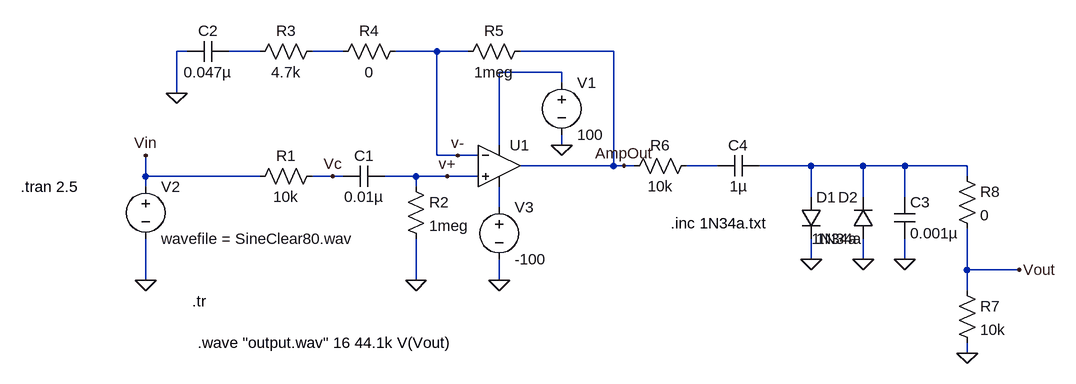
[diagram p0: schematic MxrDistortionPlus.asc]
MxrDistortionPlus.asc, the LTspice schematic file:
Version 4
SHEET 1 1316 680
WIRE -32 64 -48 64
WIRE 80 64 32 64
WIRE 208 64 160 64
WIRE 352 64 288 64
WIRE 400 64 352 64
WIRE 624 64 480 64
WIRE 544 96 448 96
WIRE 544 112 544 96
WIRE -48 128 -48 64
WIRE 448 208 448 96
WIRE 544 208 544 192
WIRE 352 224 352 64
WIRE 384 224 352 224
WIRE 416 224 384 224
WIRE 624 240 624 64
WIRE 624 240 480 240
WIRE 640 240 624 240
WIRE 656 240 640 240
WIRE 784 240 736 240
WIRE 928 240 848 240
WIRE 1008 240 928 240
WIRE 1072 240 1008 240
WIRE 1168 240 1072 240
WIRE -96 256 -96 224
WIRE 80 256 -96 256
WIRE 192 256 160 256
WIRE 208 256 192 256
WIRE 320 256 272 256
WIRE 368 256 320 256
WIRE 416 256 368 256
WIRE 1168 256 1168 240
WIRE -96 272 -96 256
WIRE 320 272 320 256
WIRE 928 288 928 240
WIRE 1008 288 1008 240
WIRE 1072 288 1072 240
WIRE 448 304 448 272
WIRE 928 384 928 352
WIRE 1008 384 1008 352
WIRE 1072 384 1072 352
WIRE 1168 400 1168 336
WIRE 1248 400 1168 400
WIRE -96 416 -96 352
WIRE 320 416 320 352
WIRE 448 416 448 384
WIRE 1168 432 1168 400
WIRE 1168 528 1168 512
FLAG 320 416 0
FLAG -96 224 Vin
FLAG 192 256 Vc
FLAG -96 416 0
FLAG 544 208 0
FLAG -48 128 0
FLAG 928 384 0
FLAG 1008 384 0
FLAG 1072 384 0
FLAG 1168 528 0
FLAG 640 240 AmpOut
FLAG 448 416 0
FLAG 1248 400 Vout
FLAG 368 256 v+
FLAG 384 224 v-
SYMBOL res 64 272 R270
WINDOW 0 32 56 VTop 2
WINDOW 3 0 56 VBottom 2
SYMATTR InstName R1
SYMATTR Value 10k
SYMBOL res 304 256 R0
SYMATTR InstName R2
SYMATTR Value 1meg
SYMBOL cap 208 272 R270
WINDOW 0 32 32 VTop 2
WINDOW 3 0 32 VBottom 2
SYMATTR InstName C1
SYMATTR Value 0.01µ
SYMBOL Opamps/UniversalOpamp2 448 240 R0
SYMATTR InstName U1
SYMBOL voltage 544 96 R0
SYMATTR InstName V1
SYMATTR Value 100
SYMBOL res 64 80 R270
WINDOW 0 32 56 VTop 2
WINDOW 3 0 56 VBottom 2
SYMATTR InstName R3
SYMATTR Value 4.7k
SYMBOL cap -32 80 R270
WINDOW 0 32 32 VTop 2
WINDOW 3 0 32 VBottom 2
SYMATTR InstName C2
SYMATTR Value 0.047µ
SYMBOL res 192 80 R270
WINDOW 0 32 56 VTop 2
WINDOW 3 0 56 VBottom 2
SYMATTR InstName R4
SYMATTR Value 0
SYMBOL res 384 80 R270
WINDOW 0 32 56 VTop 2
WINDOW 3 0 56 VBottom 2
SYMATTR InstName R5
SYMATTR Value 1meg
SYMBOL res 640 256 R270
WINDOW 0 32 56 VTop 2
WINDOW 3 0 56 VBottom 2
SYMATTR InstName R6
SYMATTR Value 10k
SYMBOL cap 1056 288 R0
SYMATTR InstName C3
SYMATTR Value 0.001µ
SYMBOL res 1152 416 R0
SYMATTR InstName R7
SYMATTR Value 10k
SYMBOL res 1152 240 R0
SYMATTR InstName R8
SYMATTR Value 0
SYMBOL voltage 448 288 R0
SYMATTR InstName V3
SYMATTR Value -100
SYMBOL voltage -96 256 R0
SYMATTR InstName V2
SYMATTR Value wavefile = SineClear80.wav
SYMBOL cap 784 256 R270
WINDOW 0 32 32 VTop 2
WINDOW 3 0 32 VBottom 2
SYMATTR InstName C4
SYMATTR Value 1µ
SYMBOL diode 912 288 R0
SYMATTR InstName D1
SYMATTR Value 1N34a
SYMBOL diode 1024 352 R180
WINDOW 0 24 64 Left 2
WINDOW 3 24 0 Left 2
SYMATTR InstName D2
SYMATTR Value 1N34a
TEXT -288 272 Left 2 !.tran 2.5
TEXT -16 512 Left 2 !.wave "output.wav" 16 44.1k V(Vout)
TEXT -24 448 Left 2 !.tr
TEXT 712 328 Left 2 !.inc 1N34a.txt

The netlist it stands for:
* MxrDistortionPlus.asc
R1 Vin Vc 10k
R2 v+ 0 1meg
C1 Vc v+ 0.01µ
XU1 v+ v- N003 N006 AmpOut level.2 Avol=1Meg GBW=10Meg Slew=10Meg ilimit=25m rail=0 Vos=0 phimargin=45 en=0 enk=0 in=0 ink=0 Rin=500Meg  ; pins IN+ IN- V+ V- OUT
V1 N003 0 100
R3 N001 N002 4.7k
C2 0 N001 0.047µ
R4 N002 v- 0
R5 v- AmpOut 1meg
R6 AmpOut N004 10k
C3 N005 0 0.001µ
R7 Vout 0 10k
R8 N005 Vout 0
V3 N006 0 -100
V2 Vin 0 wavefile = SineClear80.wav
C4 N004 N005 1µ
D1 N005 0 1N34a
D2 0 N005 1N34a
.model D D
.lib standard.dio
.tran 2.5
.wave "output.wav" 16 44.1k V(Vout)
.tr
.inc 1N34a.txt
.lib UniversalOpamps2.sub
.backanno
.end